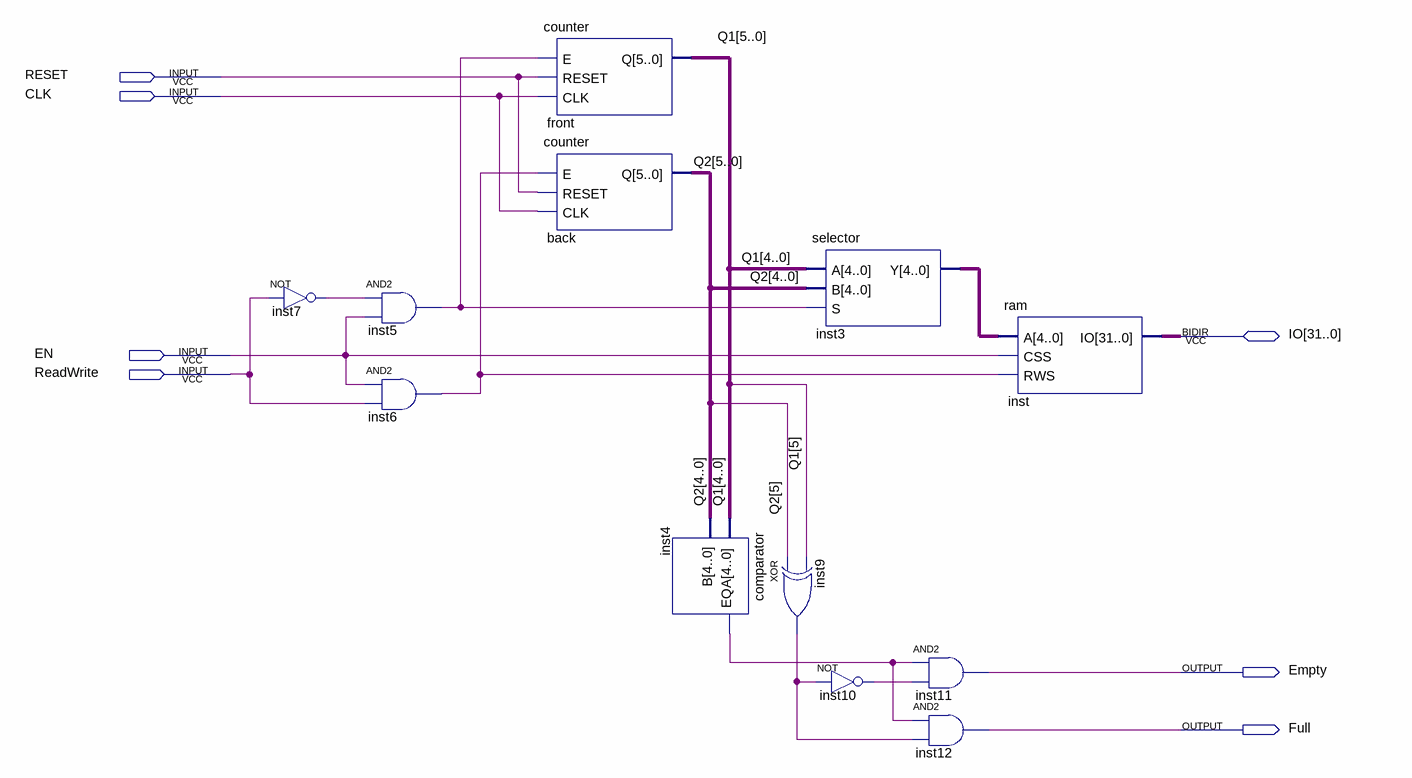
[diagram p0: schematic sheet]
// Quartus schematic queue.bdf as structural Verilog: 12 symbols, 7 pins
module queue (
  input  RESET,
  input  CLK,
  input  EN,
  input  ReadWrite,
  inout  [31:0] IO,
  output Empty,
  output Full
);

  wire inst4_eq, inst5_out, inst6_out, inst7_out, inst9_out, inst10_out;
  wire [4:0] inst3_y;
  wire [5:0] Q1, Q2;

  not inst7 (inst7_out, ReadWrite);
  and inst5 (inst5_out, inst7_out, EN);
  and inst6 (inst6_out, EN, ReadWrite);
  counter front (.E(inst5_out), .RESET(RESET), .CLK(CLK), .Q(Q1));
  counter back (.E(inst6_out), .RESET(RESET), .CLK(CLK), .Q(Q2));
  comparator inst4 (.A(Q1[4:0]), .B(Q2[4:0]), .EQ(inst4_eq));
  xor inst9 (inst9_out, Q2[5], Q1[5]);
  selector inst3 (.A(Q1[4:0]), .B(Q2[4:0]), .S(inst5_out), .Y(inst3_y));
  not inst10 (inst10_out, inst9_out);
  and inst11 (Empty, inst4_eq, inst10_out);
  and inst12 (Full, inst4_eq, inst9_out);
  ram inst (.A(inst3_y), .CSS(EN), .RWS(inst6_out), .IO(IO));
endmodule
